# EAGLE schematic mote+cc3200v4 (EAGLE 9.6.2)

## Sheet 1 of 2
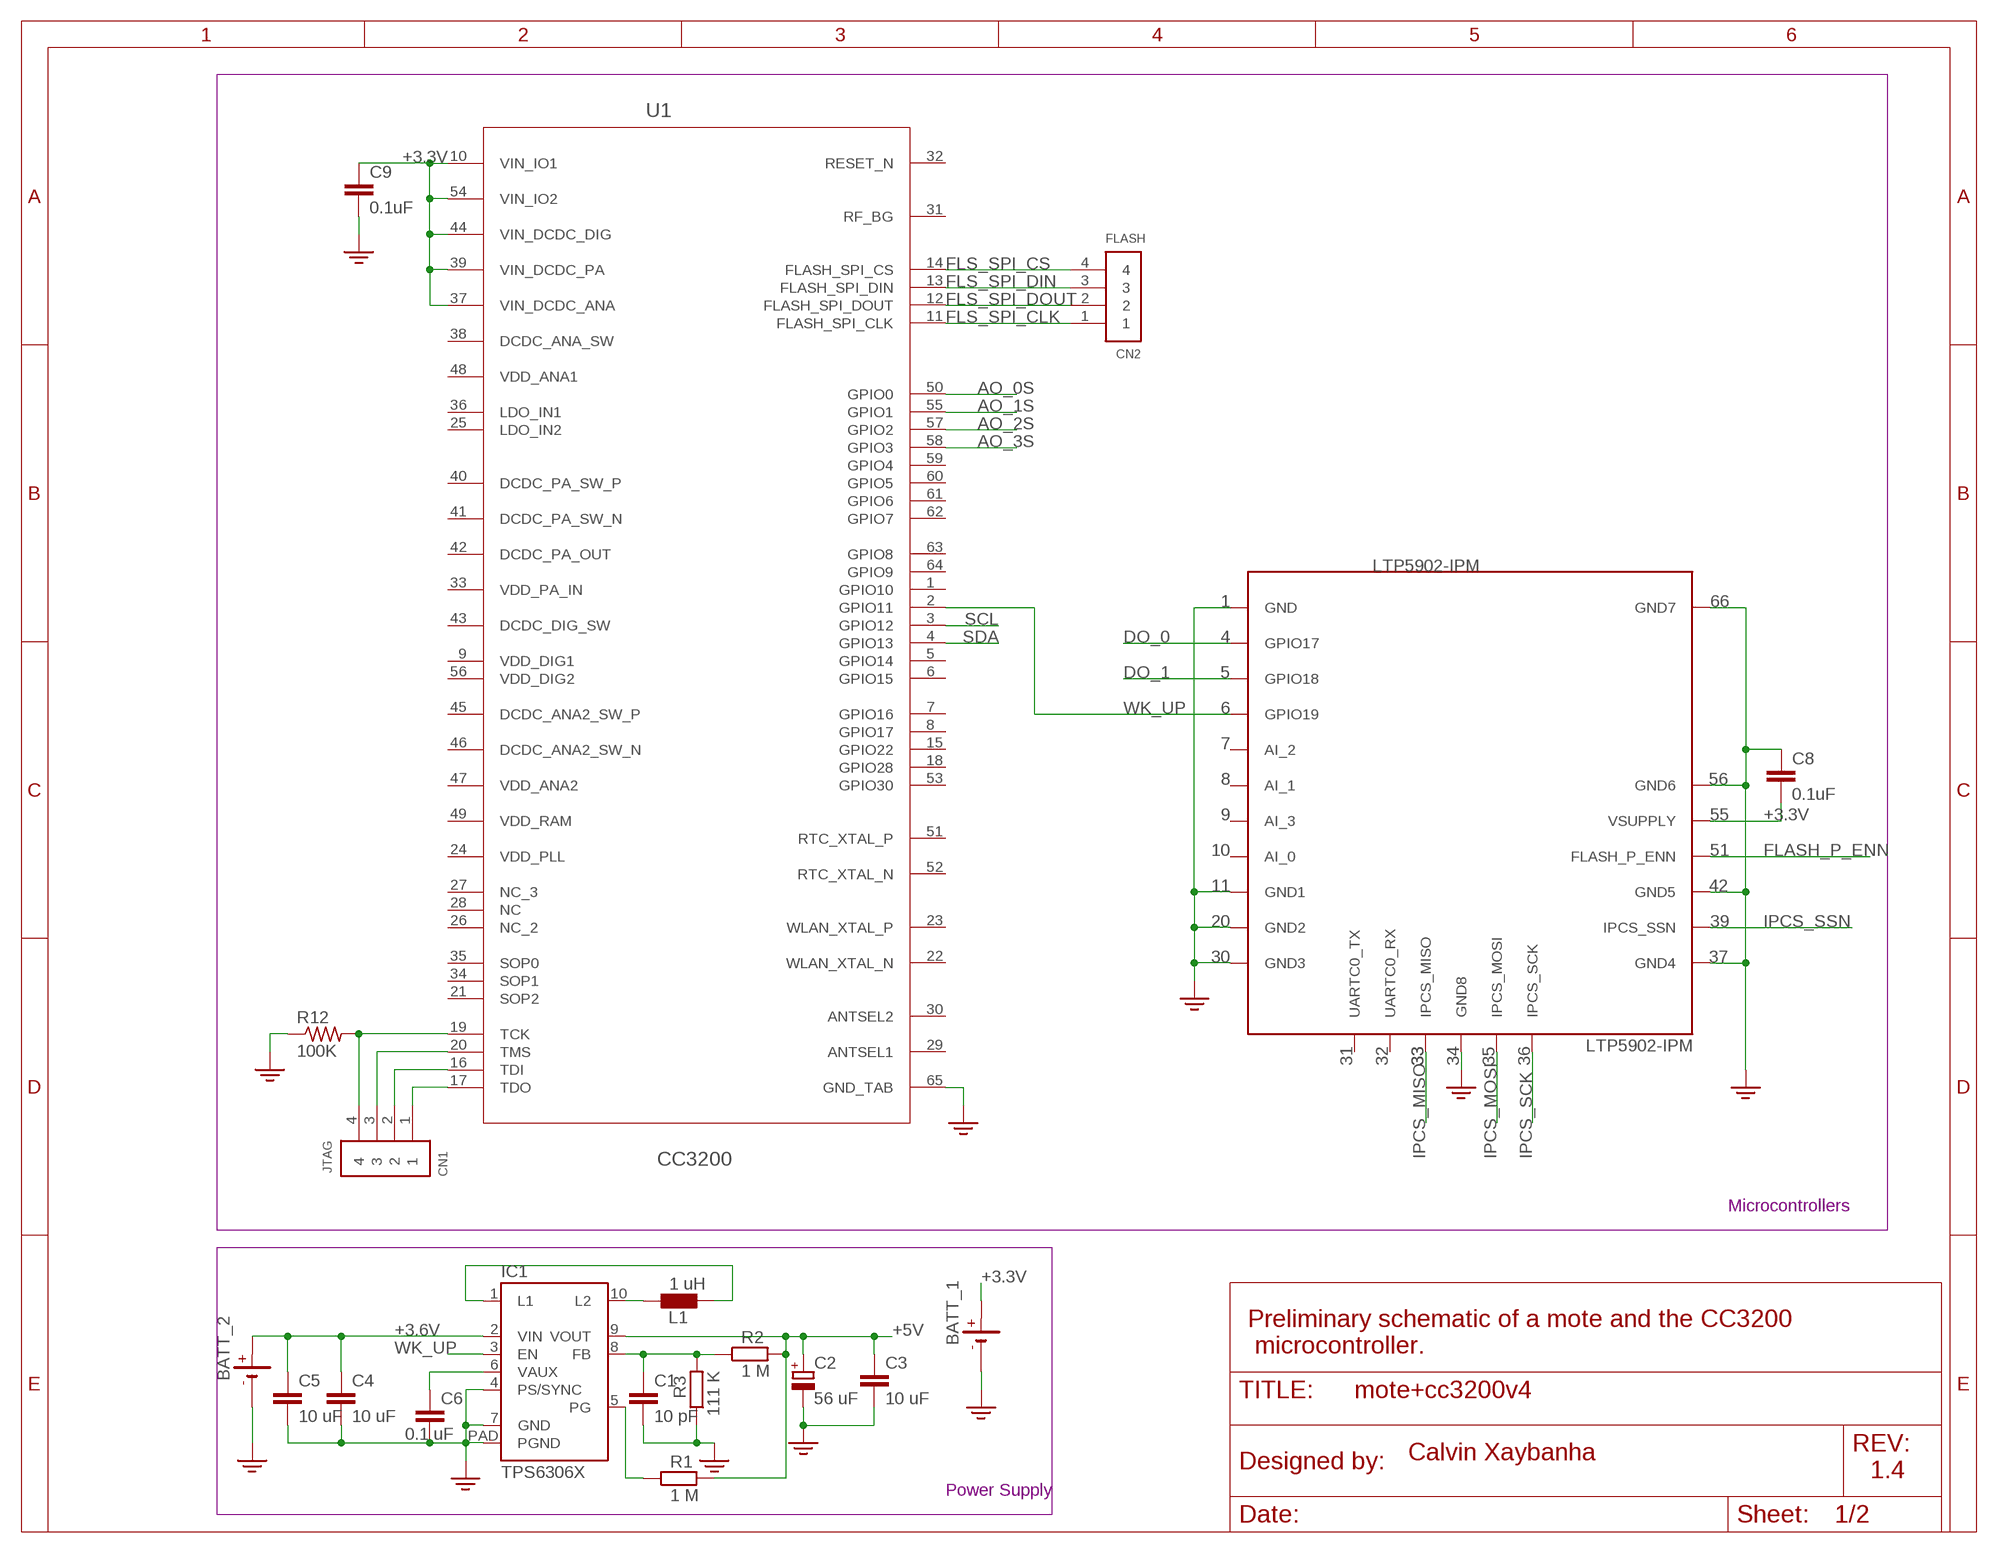
[diagram p0: schematic, sheet 1]
FRAME2 (FRAME_8.5X11): SPICEPREFIX: X

### Parts
BATT_1  BATTERY_BR1225/FA  [BATTERY_BR1225/FA]
BATT_2  BATTERY_BR1225/FA  [BATTERY_BR1225/FA]
C1  10 pF  CC1808  [C1808]
C2  56 uF  CPOL-EUE3.5-8  [E3,5-8]
C3  10 uF  CC1808  [C1808]
C4  10 uF  CC1808  [C1808]
C5  10 uF  CC1808  [C1808]
C6  0.1 uF  C-EUC1808  [C1808]
C8  0.1uF  C5/3.5  [C5B3.5]
C9  0.1uF  C5/3.5  [C5B3.5]
CN1  JTAG  1X4-BIG  [1X04-BIG]
CN2  FLASH  1X4-BIG  [1X04-BIG]
IC1  TPS6306X  [S-PWSON-N10]
L1  1 uH  L0204/7  [0204/7]
R1  1 M  R-EU_R5025  [R5025]
R2  1 M  R-EU_R5025  [R5025]
R3  111 K  R-EU_R1206  [R1206]
R12  100K  R-US_0207/10  [0207/10]
U1  CC3200  CC3200R1M2RGCR  [RGC0064A]
U5  LTP5902  [LTP5901]

### Nets
3.3V: U5.P$1(GND) U5.P$9(GND1) U5.P$10(GND2) U5.P$11(GND3) ; supply symbol labelled GND2 ; also sheet 2
+3.3V: BATT_1.+ C8.2 C9.1 U1.10(VIN_IO1) U1.37(VIN_DCDC_ANA) U1.39(VIN_DCDC_PA) U1.44(VIN_DCDC_DIG) U1.54(VIN_IO2) U5.P$22(VSUPPLY) ; also sheet 2
+3.6V: BATT_2.+ C4.1 C5.1 IC1.2(VIN)
+5V [Power]: C2.+ C3.1 IC1.9(VOUT) R1.2 R2.2 ; also sheet 2
AO_0S [Signals]: U1.50(GPIO0)
AO_1S: U1.55(GPIO1) ; also sheet 2
AO_2S [Signals]: U1.57(GPIO2) ; also sheet 2
AO_3S: U1.58(GPIO3) ; also sheet 2
DO_0 [Signals]: U5.P$2(GPIO17)
DO_1 [Signals]: U5.P$3(GPIO18)
FB_TPS: C1.1 IC1.8(FB) R2.1 R3.2
FLASH_P_ENN: U5.P$21(FLASH_P_ENN)
FLS_SPI_CLK: CN2.1 U1.11(FLASH_SPI_CLK)
FLS_SPI_CS: CN2.4 U1.14(FLASH_SPI_CS)
FLS_SPI_DIN: CN2.3 U1.13(FLASH_SPI_DIN)
FLS_SPI_DOUT: CN2.2 U1.12(FLASH_SPI_DOUT)
GND: BATT_1.- BATT_2.- C1.2 C2.- C3.2 C4.2 C5.2 C6.2 C8.1 C9.2 IC1.4(PS/SYNC) IC1.7(GND) IC1.PAD(PGND) R3.1 R12.1 U1.65(GND_TAB) U5.P$15(GND8) U5.P$18(GND4) U5.P$20(GND5) U5.P$23(GND6) U5.P$24(GND7) ; supply symbol labelled GND2 ; also sheet 2
IPCS_MISO: U5.P$14(IPCS_MISO)
IPCS_MOSI: U5.P$16(IPCS_MOSI)
IPCS_SCK: U5.P$17(IPCS_SCK)
IPCS_SSN: U5.P$19(IPCS_SSN)
L_TPS1: IC1.1(L1) L1.2
L_TPS2: IC1.10(L2) L1.1
N$1: CN1.4 R12.2 U1.19(TCK)
N$2: CN1.3 U1.20(TMS)
N$3: CN1.2 U1.16(TDI)
N$4: CN1.1 U1.17(TDO)
PG_TPS: IC1.5(PG) R1.1
SCL [Signals]: U1.3(GPIO12) ; also sheet 2
SDA [Signals]: U1.4(GPIO13) ; also sheet 2
VAUX_TPS: C6.1 IC1.6(VAUX)
WK_UP [Signals]: IC1.3(EN) U1.2(GPIO11) U5.P$4(GPIO19)
Unconnected: U1.1(GPIO10) U1.5(GPIO14) U1.6(GPIO15) U1.7(GPIO16) U1.8(GPIO17) U1.15(GPIO22) U1.18(GPIO28) U1.21(SOP2) U1.22(WLAN_XTAL_N) U1.23(WLAN_XTAL_P) U1.26(NC_2) U1.27(NC_3) U1.28(NC) U1.29(ANTSEL1) U1.30(ANTSEL2) U1.31(RF_BG) U1.32(RESET_N) U1.34(SOP1) U1.35(SOP0) U1.45(DCDC_ANA2_SW_P) U1.46(DCDC_ANA2_SW_N) U1.51(RTC_XTAL_P) U1.52(RTC_XTAL_N) U1.53(GPIO30) U1.59(GPIO4) U1.60(GPIO5) U1.61(GPIO6) U1.62(GPIO7) U1.63(GPIO8) U1.64(GPIO9) U5.P$5(AI_2) U5.P$6(AI_1) U5.P$7(AI_3) U5.P$8(AI_0) U5.P$12(UARTC0_TX) U5.P$13(UARTC0_RX)

### Notes on the sheet
- 1 | 66
- 4
- 5
- 6
- 7
- 8 | 56
- 9 | 55
- 10 | 51
- 11 | 42
- 20 | 39
- 30 | 37
- 31 | 32 | 33 | 33 | 34 | 35 | 36
- LTP5902-IPM
- Microcontrollers
- Preliminary schematic of a mote and the CC3200
   microcontroller.
- Calvin Xaybanha
- 1.4
- Power Supply

## Sheet 2 of 2
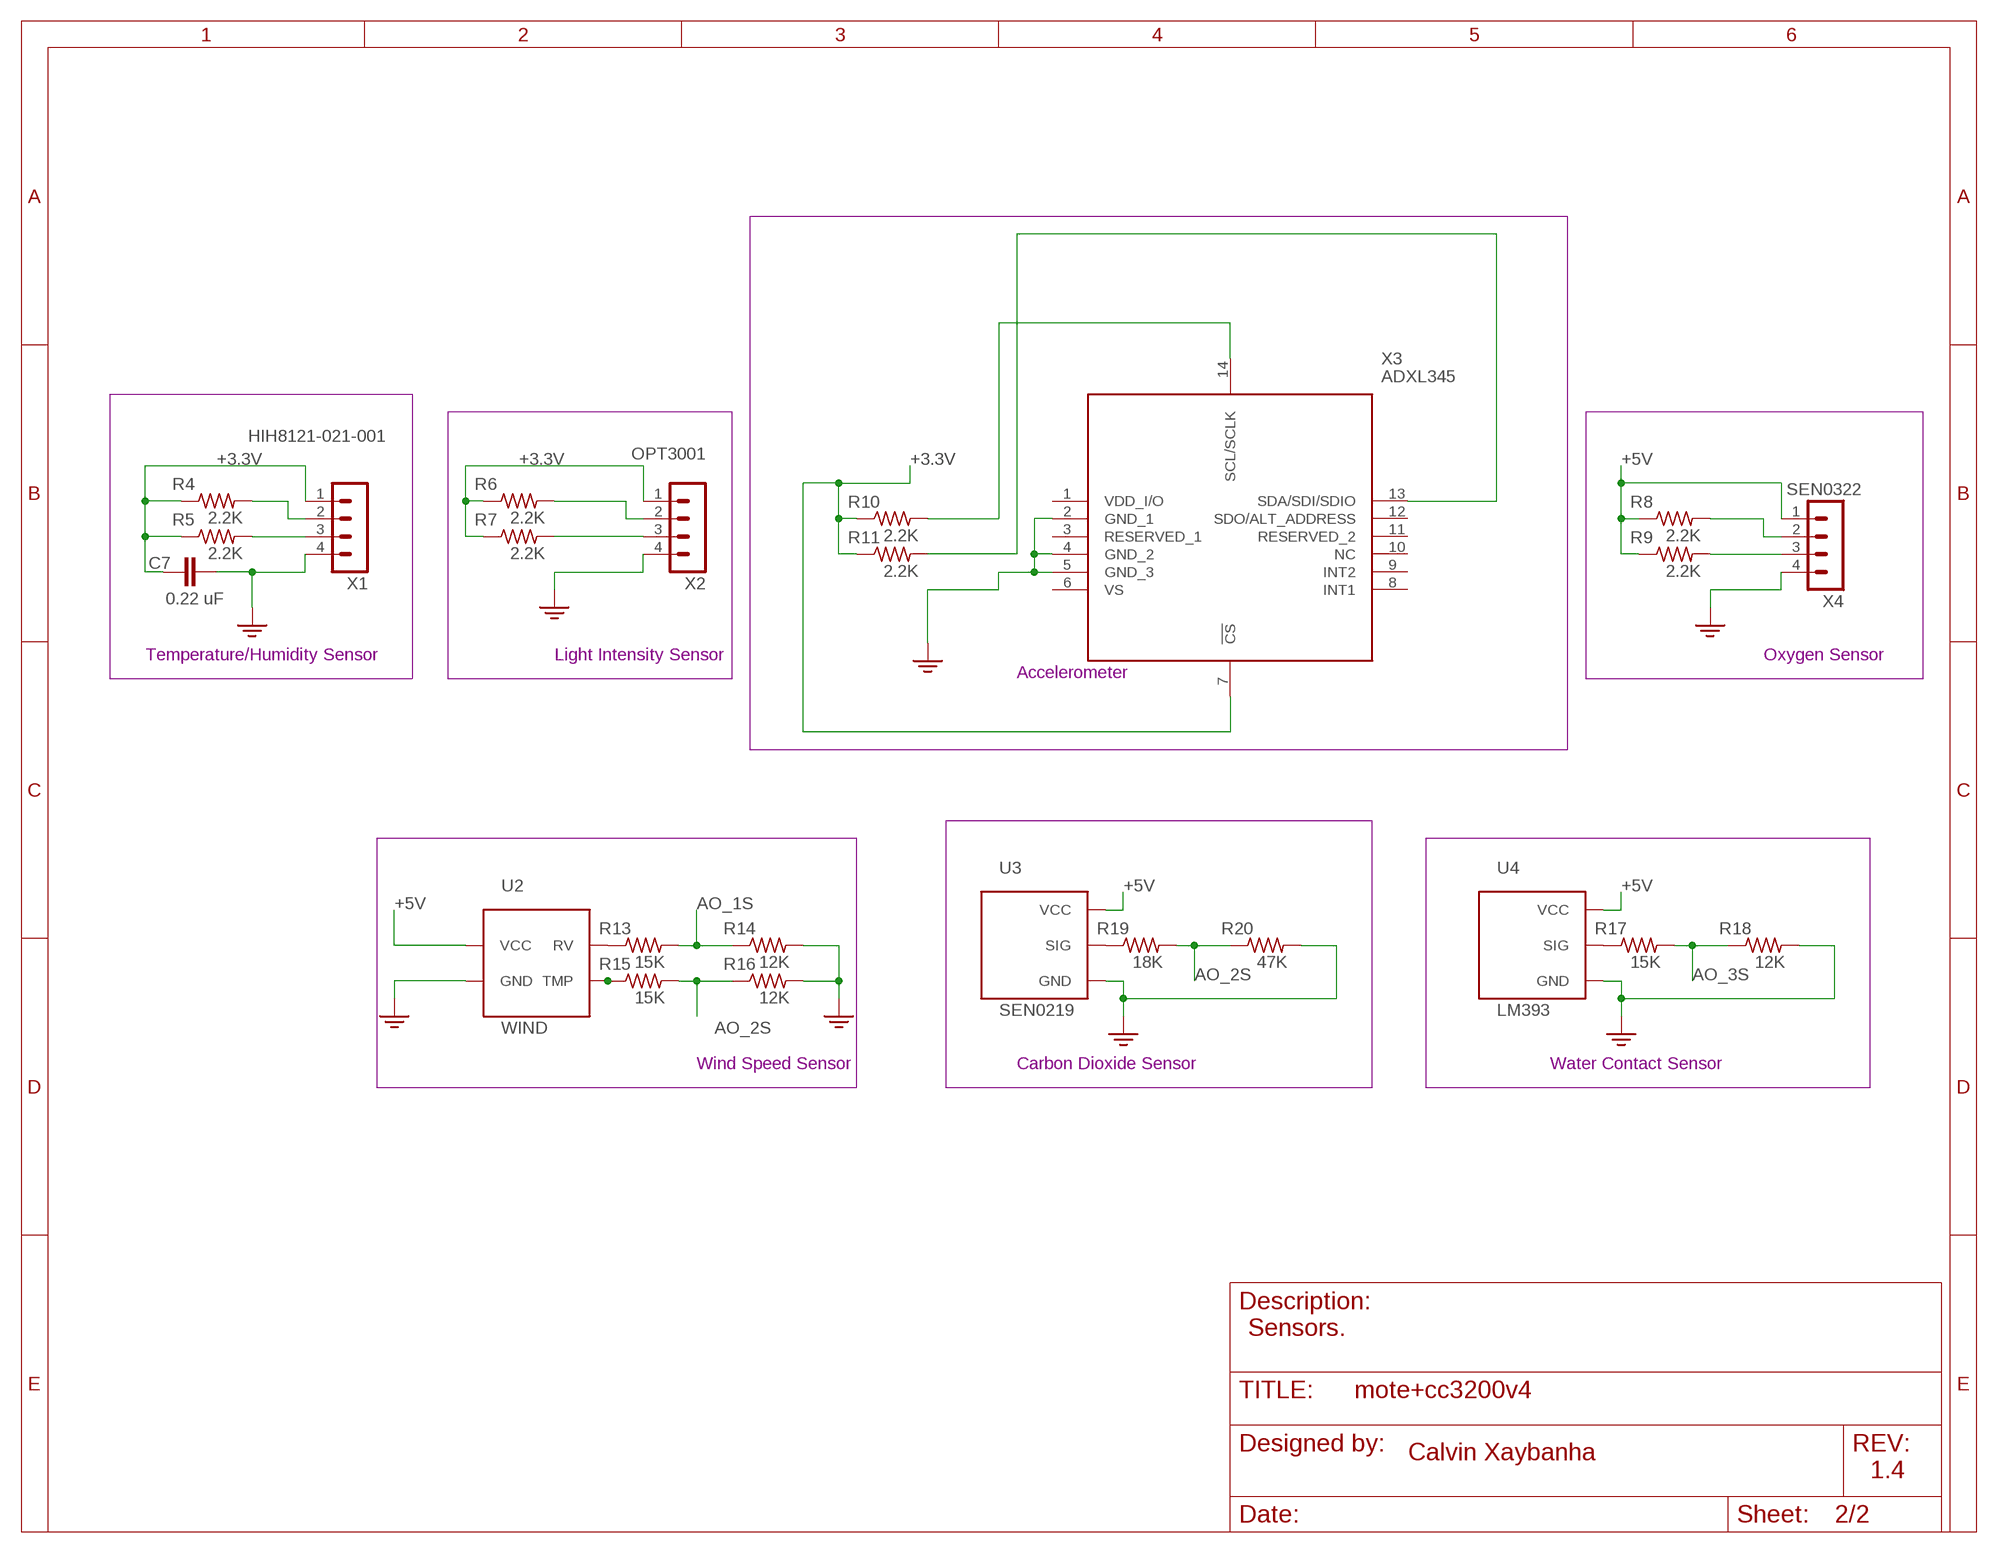
[diagram p1: schematic, sheet 2]

### Parts
C7  0.22 uF  C5/3.5  [C5B3.5]
R4  2.2K  R-US_0207/9  [0207/9]
R5  2.2K  R-US_0207/9  [0207/9]
R6  2.2K  R-US_0207/9  [0207/9]
R7  2.2K  R-US_0207/9  [0207/9]
R8  2.2K  R-US_0207/9  [0207/9]
R9  2.2K  R-US_0207/9  [0207/9]
R10  2.2K  R-US_0207/9  [0207/9]
R11  2.2K  R-US_0207/9  [0207/9]
R13  15K  R-US_0207/9  [0207/9]
R14  12K  R-US_0207/9  [0207/9]
R15  15K  R-US_0207/9  [0207/9]
R16  12K  R-US_0207/9  [0207/9]
R17  15K  R-US_0207/9  [0207/9]
R18  12K  R-US_0207/9  [0207/9]
R19  18K  R-US_0207/9  [0207/9]
R20  47K  R-US_0207/9  [0207/9]
U2  WIND  [WIND]
U3  SEN0219  [SEN0219]
U4  LM393  [LM393]
X1  HIH8121-021-001  B4B-PH-K-S  [B4B-PH-K-S]
X2  OPT3001  B4B-PH-K-S  [B4B-PH-K-S]
X3  ADXL345  [CC-14-1]
X4  SEN0322  B4B-PH-K-S  [B4B-PH-K-S]

### Nets
3.3V: R14.2 R16.2 ; supply symbol labelled GND2 ; also sheet 1
+3.3V: C7.1 R4.1 R5.1 R6.1 R7.1 R10.1 R11.1 X1.1 X2.1 X3.7(!CS) ; also sheet 1
+5V [Power]: R8.1 R9.1 U2.P$1(VCC) U3.P$1(VCC) U4.P$1(VCC) X4.1 ; also sheet 1
AO_1S: R13.2 R14.1 ; also sheet 1
AO_2S [Signals]: R15.2 R16.1 R19.2 R20.1 ; also sheet 1
AO_3S: R17.2 R18.1 ; also sheet 1
GND: C7.2 R18.2 R20.2 U2.P$2(GND) U3.P$3(GND) U4.P$3(GND) X1.4 X2.4 X3.2(GND_1) X3.4(GND_2) X3.5(GND_3) X4.4 ; supply symbol labelled GND2 ; also sheet 1
N$5: R7.2 X2.3
N$6: R11.2 X3.13(SDA/SDI/SDIO)
N$7: R13.1 U2.P$3(RV)
N$8: R17.1 U4.P$2(SIG)
N$9: R15.1 U2.P$4(TMP)
N$10: R19.1 U3.P$2(SIG)
SCL [Signals]: R4.2 R6.2 R8.2 R10.2 X1.2 X2.2 X3.14(SCL/SCLK) X4.2 ; also sheet 1
SDA [Signals]: R5.2 R9.2 X1.3 X4.3 ; also sheet 1
Unconnected: X3.3(RESERVED_1) X3.6(VS) X3.8(INT1) X3.9(INT2) X3.10(NC) X3.11(RESERVED_2) X3.12(SDO/ALT_ADDRESS)

### Notes on the sheet
- Temperature/Humidity Sensor | Light Intensity Sensor | Oxygen Sensor
- Accelerometer
- Wind Speed Sensor | Carbon Dioxide Sensor | Water Contact Sensor
- Sensors.
- Calvin Xaybanha
- 1.4

## Power pins joined to a net without a drawn wire
DCDC_ANA_SW: U1.38(DCDC_ANA_SW)
DCDC_DIG_SW: U1.43(DCDC_DIG_SW)
DCDC_PA_OUT: U1.42(DCDC_PA_OUT)
DCDC_PA_SW_N: U1.41(DCDC_PA_SW_N)
DCDC_PA_SW_P: U1.40(DCDC_PA_SW_P)
LDO_IN1: U1.36(LDO_IN1)
LDO_IN2: U1.25(LDO_IN2)
VDD_ANA1: U1.48(VDD_ANA1)
VDD_ANA2: U1.47(VDD_ANA2)
VDD_DIG1: U1.9(VDD_DIG1)
VDD_DIG2: U1.56(VDD_DIG2)
VDD_I/O: X3.1(VDD_I/O)
VDD_PA_IN: U1.33(VDD_PA_IN)
VDD_PLL: U1.24(VDD_PLL)
VDD_RAM: U1.49(VDD_RAM)

## Library data of the parts
BATT_1 BATT_2 = 52101-101-REV-A_v16:BATTERY_BR1225/FA: BATT LITH COIN 3V
C1 C3-C5 = eagle-ltspice:C: CAPACITOR, European symbol; SPICEMODEL: NONE; SPICEPREFIX: C
C2 = rcl:CPOL-EU: POLARIZED CAPACITOR, European symbol; SPICEPREFIX: C
C6 = rcl:C-EU: CAPACITOR, European symbol; SPICEPREFIX: C
C7-C9 = capacitor-wima:C: CAPACITOR naming: grid - package width
CN1 CN2 = adafruit:1X4: 4-pin connector
IC1 = m_vreg:TPS6306X: TPS6306x High Input Voltage, Buck-Boost Converter With 2-A Switch Current Features Input Voltage Range: 2.5 V to 12 V Efficiency: Up to 93% Output Current at 5 V (VIN<10 V): 2 A in Buck Mode Output Current at 5 V (VIN>4 V): 1.3 A in Boost Mode Automatic Transition Between Step Down and Boost Mode Typical Device Quiescent Current: < 30 μA Fixed and Adjustable Output Voltage Options from 2.5 V to 8 V Power-Save Mode for Improved Efficiency at Low Output Power Forced Fixed-Frequency Operation at 2.4 MHz and Synchronization Possible Power Good Output Buck-Boost Overlap ControlTM Load Disconnect During Shutdown Overtemperature Protection Overvoltage Protection Description The TPS6306x devices provide a power supply solution for products powered by either three-cell up to six-cell alkaline, NiCd or NiMH battery, or a one- cell or dual-cell Li-Ion or Li-polymer battery. Output currents can go as high as 2-A while using a dual-cell Li-Ion or Li-polymer battery, and discharge it down to 5 V or lower. The buck-boost converter is based on a fixed frequency, pulse-width-modulation (PWM) controller using synchronous rectification to obtain maximum efficiency. At low load currents, the converter enters power-save mode to maintain high efficiency over a wide load current range. The power- save mode can be disabled, forcing the converter to operate at a fixed switching frequency. The maximum average current in the switches is limited to a typical value of 2.25 A. The output voltage is programmable using an external resistor divider, or is fixed internally on the chip. The converter can be disabled to minimize battery drain. During shutdown, the load is disconnected from the battery. The devices are available in a 3 mm × 3 mm, 10-pin, WSON (DSC), PowerPADTM package. Information based on TI document SLVSA92B – DECEMBER 2011 – REVISED DECEMBER 2014 Added 2016-07-24; MANUF: TI; PARTNUM: TPS6306X
L1 = eagle-ltspice:L: INDUCTOR, European symbol; SPICEMODEL: NONE; SPICEPREFIX: L
R1-R3 = rcl:R-EU_: RESISTOR, European symbol; SPICEPREFIX: R
R4-R11 R13-R20 = adafruit:R-US_: RESISTOR, American symbol
R12 = resistor:R-US_: RESISTOR, American symbol
U1 = CC3200:CC3200R1M2RGCR; ALTERNATEPARTNUMBER: CC3200R1M2RGC; COMPTYPE: IC; MANUFACTURER: Texas Instruments; MOUNTTYPE: SMT; PACKAGEREFERENCE: RGC0064A; PARTNUMBER: CC3200R1M2RGCR; PIN_COUNT: 65; REFDES: RefDes; ROHS: Y; TYPE: TYPE; VALUE: Value
U2 = WINDc:WIND
U3 = SEN0219c:SEN0219
U4 = LM393c:LM393
U5 = LTP5902c:LTP5902
X1 X2 X4 = con-JST PH:B4B-PH: JST PH series header 2.00mm pitch disconnectable crimp style connectors, vertical (side entry type), 4 pins
X3 = ADXL345:ADXL345: 3-Axis Accelerometer IC Source: Datasheet <http://www.analog.com/media/en/technical-documentation/data-sheets/ADXL345.pdf>; DESCRIPTION: 3-Axis Accelerometer IC; HEIGHT: mm; MANUFACTURER_NAME: Analog Devices; MANUFACTURER_PART_NUMBER: ADXL345; MOUSER_PART_NUMBER: N/A; MOUSER_PRICE-STOCK: https://www.mouser.co.uk/ProductDetail/Analog-Devices/ADXL345?qs=5aG0NVq1C4y%252BItyqaAF9pQ%3D%3D